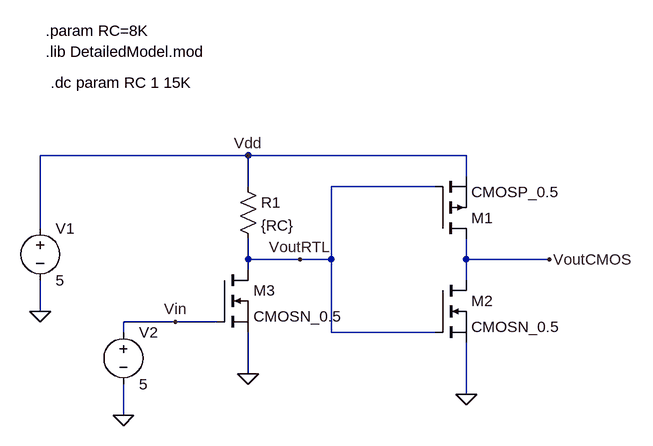
[diagram p0: schematic rtl_cmos.asc]
rtl_cmos.asc, the LTspice schematic file:
Version 4
SHEET 1 972 680
WIRE 368 -16 48 -16
WIRE 704 -16 368 -16
WIRE 704 16 704 -16
WIRE 368 32 368 -16
WIRE 656 32 496 32
WIRE 48 96 48 -16
WIRE 368 144 368 112
WIRE 448 144 368 144
WIRE 496 144 496 32
WIRE 496 144 448 144
WIRE 704 144 704 112
WIRE 832 144 704 144
WIRE 368 160 368 144
WIRE 704 176 704 144
WIRE 48 224 48 176
WIRE 256 240 176 240
WIRE 320 240 256 240
WIRE 176 256 176 240
WIRE 496 256 496 144
WIRE 656 256 496 256
WIRE 368 320 368 256
WIRE 704 352 704 272
WIRE 176 384 176 336
FLAG 48 224 0
FLAG 176 384 0
FLAG 368 320 0
FLAG 704 352 0
FLAG 368 -16 Vdd
FLAG 256 240 Vin
FLAG 832 144 VoutCMOS
FLAG 448 144 VoutRTL
SYMBOL voltage 48 80 R0
SYMATTR InstName V1
SYMATTR Value 5
SYMBOL pmos 656 112 M180
SYMATTR InstName M1
SYMATTR Value CMOSP_0.5
SYMBOL nmos 656 176 R0
SYMATTR InstName M2
SYMATTR Value CMOSN_0.5
SYMBOL nmos 320 160 R0
SYMATTR InstName M3
SYMATTR Value CMOSN_0.5
SYMBOL res 352 16 R0
SYMATTR InstName R1
SYMATTR Value {RC}
SYMBOL voltage 176 240 R0
WINDOW 123 0 0 Left 0
WINDOW 39 0 0 Left 0
SYMATTR InstName V2
SYMATTR Value 5
TEXT 56 -208 Left 2 !.param RC=8K
TEXT 56 -176 Left 2 !.lib DetailedModel.mod
TEXT 64 -128 Left 2 !.dc param RC 1 15K

The netlist it stands for:
* rtl_cmos.asc
V1 Vdd 0 5
M1 VoutCMOS VoutRTL Vdd Vdd CMOSP_0.5
M2 VoutCMOS VoutRTL 0 0 CMOSN_0.5
M3 VoutRTL Vin 0 0 CMOSN_0.5
R1 Vdd VoutRTL {RC}
V2 Vin 0 5
.model NMOS NMOS
.model PMOS PMOS
.lib standard.mos
.param RC=8K
.lib DetailedModel.mod
.dc param RC 1 15K
.backanno
.end